# EasyEDA Pro project TL060FVXS07.eprj

# Schematic 6inch_mipi_V1.0
Board Name: shimeta_6inch_mipi_V1.0; Create Date: 2026-04-24; Page Name: 6inch_mipi_V1.0; Project Name: TL060FVXS07; Schematic Name: 6inch_mipi_V1.0; Update Date: 2026-05-01; Address1: *; Address2: *; Address3: *; Address4: *; Application_BuildNumber: *; ApprovedBy: *; Author: *; CheckedBy: *; CompanyName: *; CurrentDate: *; CurrentTime: *; Date: *; DocumentFullPathAndName: *; DocumentName: *; DocumentNumber: *; DrawnBy: *; Engineer: *; ImagePath: *; ModifiedDate: *; Organization: *; ProjectName: *; Revision: *; Rule: *; SheetNumber: 1; SheetTotal: 1; Time: *; Title: *
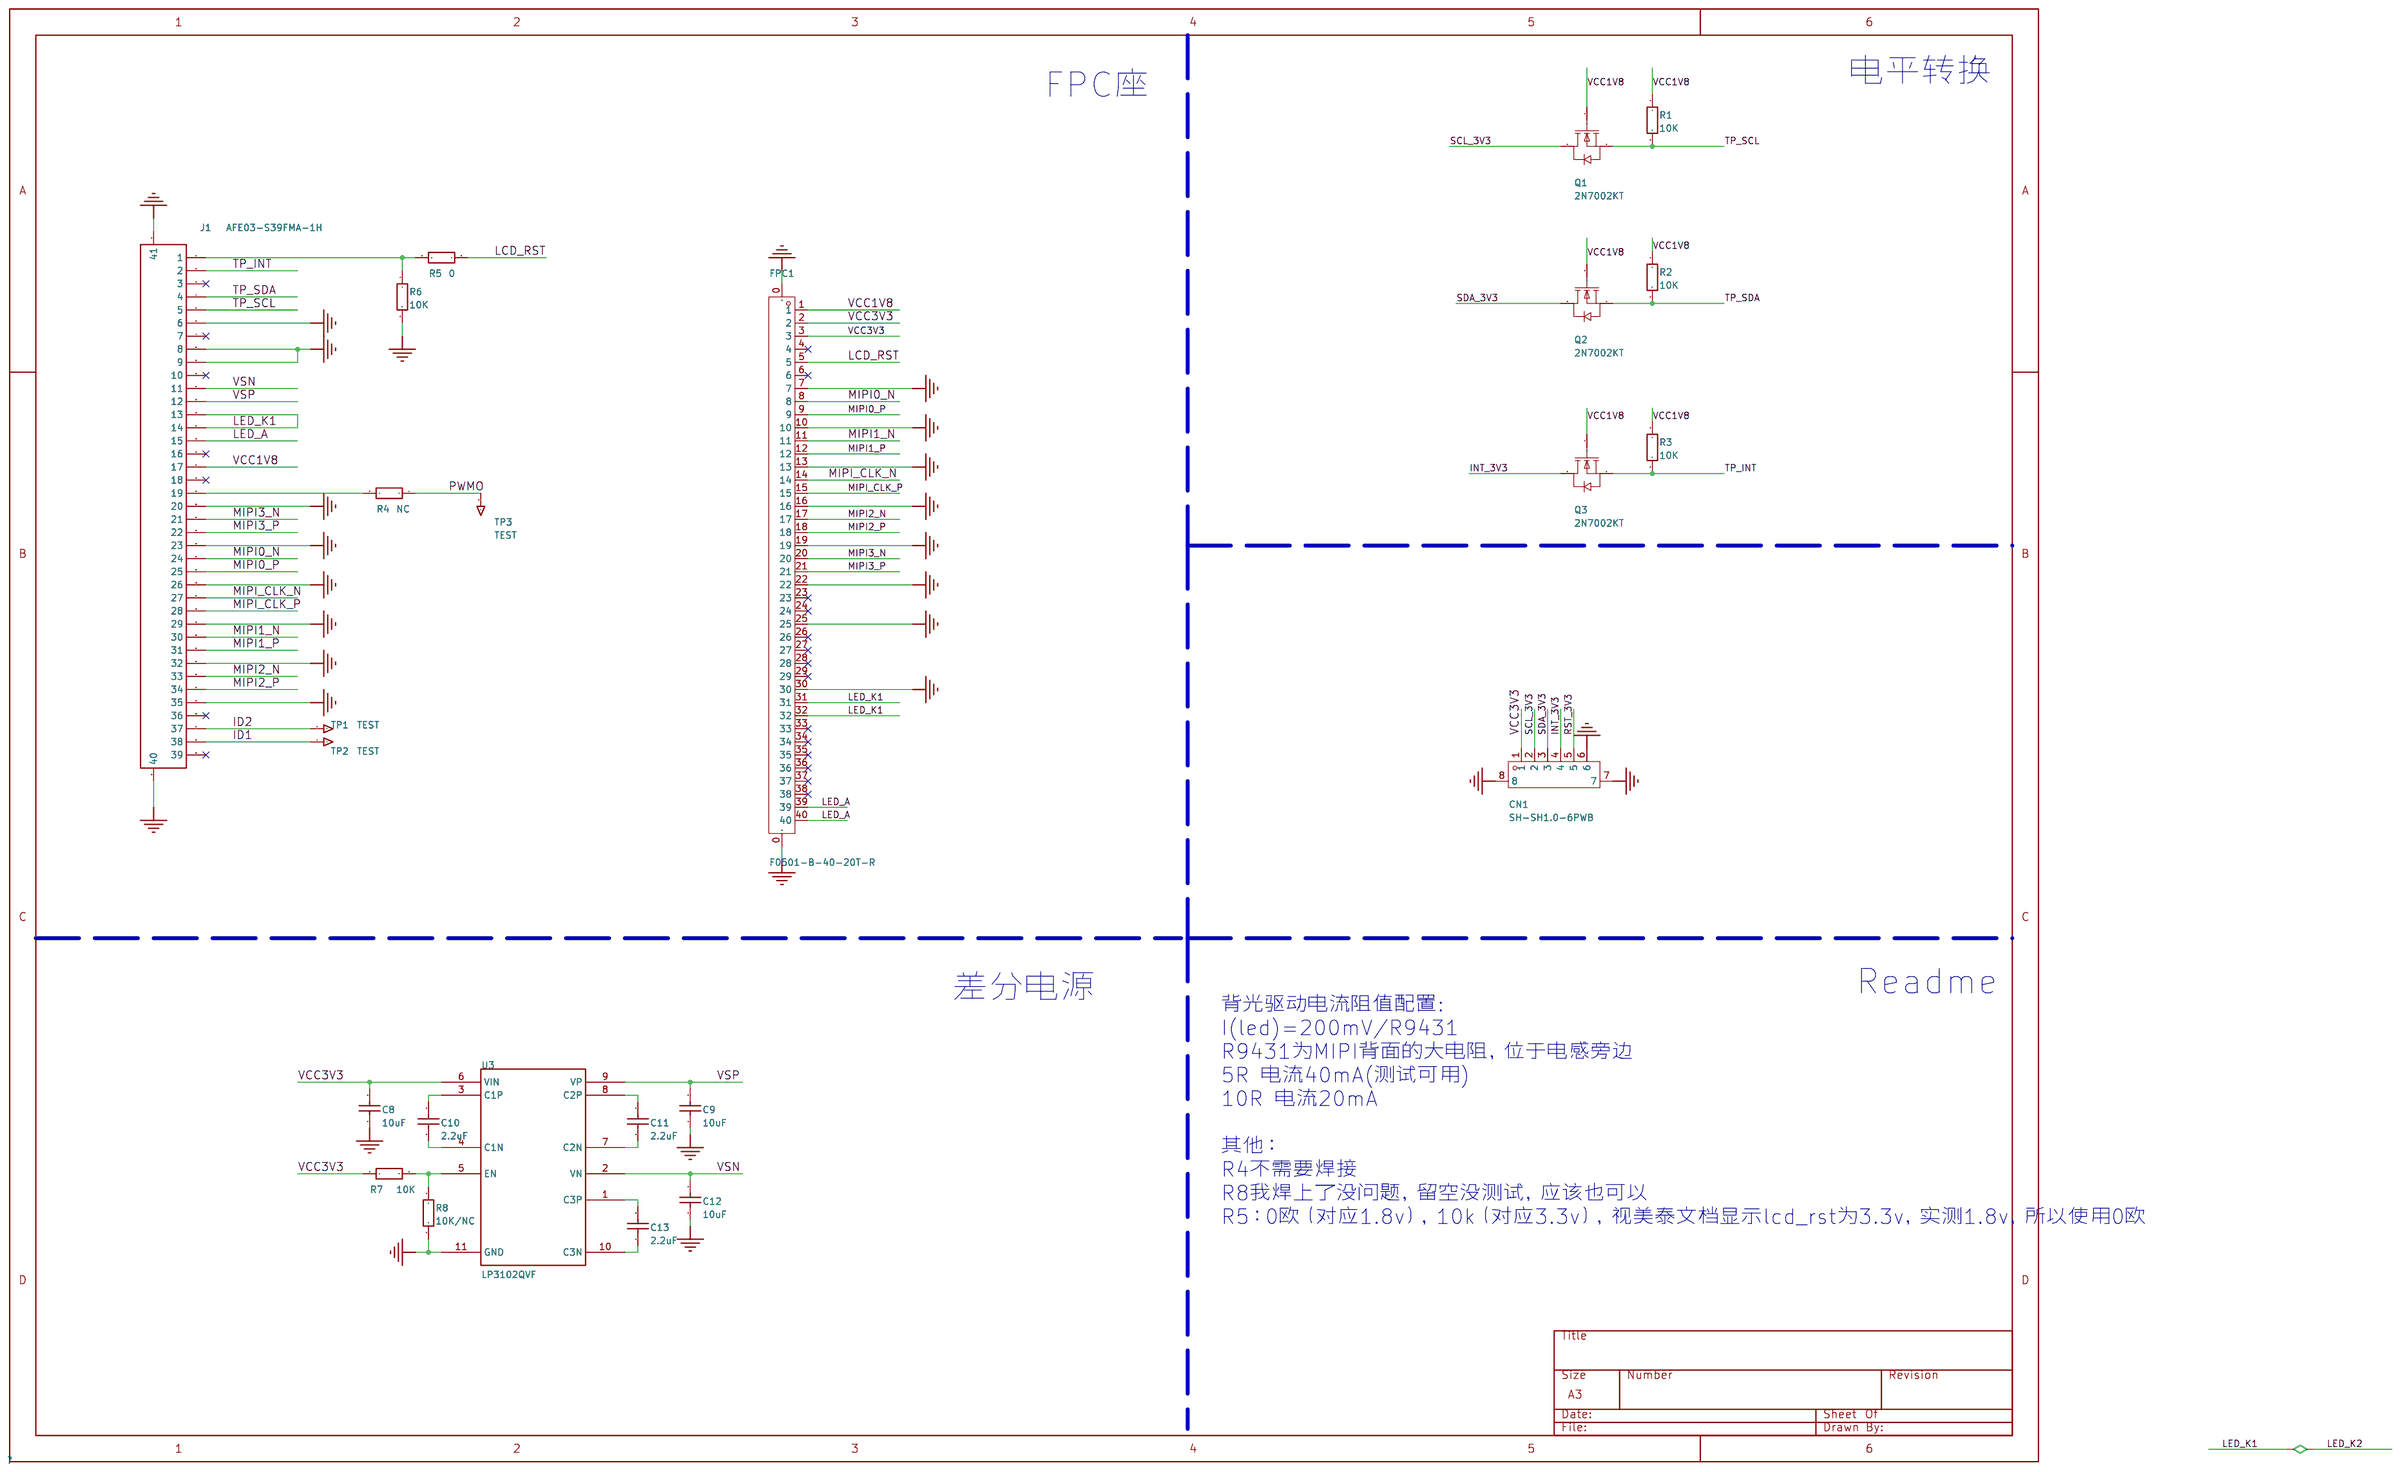
[diagram p0: schematic sheet]

## Parts
C8  10uF  [C0402_L]
C9  10uF  [C0402_L]
C10  2.2uF  [C0402_L]
C11  2.2uF  [C0402_L]
C12  10uF  [C0402_L]
C13  2.2uF  [C0402_L]
CN1  SH-SH1.0-6PWB  [CONN-SMD_6P-P1.00_SH-SH1.0-6PWB]
FPC1  F0501-B-40-20T-R  [FPC-SMD_40P-P0.50_L4.4-W25.6]
J1  AFE03-S39FMA-1H  [FPC-SMD_P0.30-39P_FGS-XJ-H1.0]
Q1  2N7002KT  [SOT-523_L1.6-W0.8-P0.95-LS1.6-BR]
Q2  2N7002KT  [SOT-523_L1.6-W0.8-P0.95-LS1.6-BR]
Q3  2N7002KT  [SOT-523_L1.6-W0.8-P0.95-LS1.6-BR]
R1  10K  [R0402_L]
R2  10K  [R0402_L]
R3  10K  [R0402_L]
R4  NC  [R0402_L]
R5  0  [R0402_L]
R6  10K  [R0402_L]
R7  10K  [R0402_L]
R8  10K/NC  [R0402_L]
TP1  TEST  [TEST 1.6]
TP2  TEST  [TEST 1.6]
TP3  TEST  [TEST 1.6]
U3  LP3102QVF  [TDFN-10_L3.0-W3.0-P0.50-BL-EP]

## Library data of the parts
C8 C9 C12 = 10uF: 贴片电容/MLCC电容; BOM名称: 无极性贴片电容; 联系卖家，免费查找封装: 唯一出售店铺网址https://shop463601444.taobao.com; Origin Footprint 1: C0201_L; Origin Footprint 2: C0603_L; Origin Footprint 3: C0805_L; Origin Footprint 4: C1206_L; Origin Footprint 5: C1210_L; Origin Footprint 6: C1808_L; Origin Footprint 7: C1812_L; Origin Footprint 8: C1825_L; Origin Footprint 9: C2225_L; Origin Footprint 10: C0201_M; Origin Footprint 11: C0402_M; Origin Footprint 12: C0603_M; Origin Footprint 13: C0805_M; Origin Footprint 14: C1206_M; Origin Footprint 15: C1210_M; Origin Footprint 16: C1808_M; Origin Footprint 17: C1812_M; Origin Footprint 18: C1825_M; Origin Footprint 19: C2225_M; Origin Footprint 20: C0201_NS; Origin Footprint 21: C0402_NS; Origin Footprint 22: C01005_NS; Design Item ID: C; Library Name: 0.1 - 电阻-电容-电感-晶振-晶体-磁珠-电位器-法拉电容-馈通电容
C10 C11 C13 = 2.2uF: 贴片电容/MLCC电容; BOM名称: 无极性贴片电容; 联系卖家，免费查找封装: 唯一出售店铺网址https://shop463601444.taobao.com; Origin Footprint 1: C0201_L; Origin Footprint 2: C0603_L; Origin Footprint 3: C0805_L; Origin Footprint 4: C1206_L; Origin Footprint 5: C1210_L; Origin Footprint 6: C1808_L; Origin Footprint 7: C1812_L; Origin Footprint 8: C1825_L; Origin Footprint 9: C2225_L; Origin Footprint 10: C0201_M; Origin Footprint 11: C0402_M; Origin Footprint 12: C0603_M; Origin Footprint 13: C0805_M; Origin Footprint 14: C1206_M; Origin Footprint 15: C1210_M; Origin Footprint 16: C1808_M; Origin Footprint 17: C1812_M; Origin Footprint 18: C1825_M; Origin Footprint 19: C2225_M; Origin Footprint 20: C0201_NS; Origin Footprint 21: C0402_NS; Origin Footprint 22: C01005_NS; Design Item ID: C; Library Name: 0.1 - 电阻-电容-电感-晶振-晶体-磁珠-电位器-法拉电容-馈通电容
CN1 = SH-SH1.0-6PWB: LCSC Part Name: 1.0-6P卧贴 编带; Supplier Part: C42372466; Manufacturer: SHOU HAN(首韩); Supplier Footprint: SMD,P=1mm,卧贴; Datasheet: https://item.szlcsc.com/datasheet/SH-SH1.0-6PWB/44255904.html; Supplier: LCSC; Pins Structure: 1x6P; Pitch: 1mm; Mounting Type: 卧贴; Reference Series: SH; Number of Pins: 6P; Number of Rows: 1; Number of PINs Per Row: 6; Current Rating: 1A; Contact Material: 磷青铜; Contact Plating: 锡; Operating Temperature: -25℃~+85℃; Voltage Rating: 125V; Plastic Material: LCP; Flame Retardant Rating: UL94V-0; Color: 米色
FPC1 = F0501-B-40-20T-R: LCSC Part Name: 抽屉式 下接 P数:40P 间距:0.5mm; Supplier Part: C481234; Manufacturer: XFCN(兴飞); Supplier Footprint: SMD,P=0.5mm,卧贴; JLCPCB Part Class: Extended Part; Datasheet: https://item.szlcsc.com/datasheet/F0501-B-40-20T-R/488819.html; Supplier: LCSC; Locking Feature: 抽屉式; Contact Type: 下接; Number of Contacts: 40P; Pitch: 0.5mm; Mounting Type: 卧贴; Height Above Board: 2mm; Contact Material: 磷青铜; Contact Plating: 锡; Operating Temperature: -25℃~+85℃; Rated Voltage (Max): 50V; Current Rating (Max): 400mA
J1 = AFE03-S39FMA-1H: FPC座下接 0.3mm 39P; Library Name: 个人库
Q1-Q3 = 2N7002KT_C45406498: LCSC Part Name: 60V N通道增强模式MOSFET; Supplier Part: C45406498; Manufacturer: MDD(辰达半导体); Supplier Footprint: SOT-523; JLCPCB Part Class: Extended Part; Datasheet: https://item.szlcsc.com/datasheet/2N7002KT/47507896.html; Supplier: LCSC; Drain to Source Voltage: 60V; Current - Continuous Drain(Id): 340mA; RDS(on): 3.2Ω@4.5V; Pd - Power Dissipation: 150mW; Gate Threshold Voltage (Vgs(th)): 2.5V@1mA; Input Capacitance(Ciss): 40pF; Reverse Transfer Capacitance (Crss@Vds): 10pF; Type: N沟道; Output Capacitance(Coss): 30pF
R1-R3 R6 R8 = 10K/NC: 贴片电阻; BOM名称: 贴片电阻; 联系卖家，免费查找封装: 唯一出售店铺网址https://shop463601444.taobao.com; Origin Footprint 1: R0201_L; Origin Footprint 2: R0603_L; Origin Footprint 3: R0805_L; Origin Footprint 4: R1206_L; Origin Footprint 5: R1210_L; Origin Footprint 6: R1812_L; Origin Footprint 7: R2010_L; Origin Footprint 8: R2512_L; Origin Footprint 9: R0201_M; Origin Footprint 10: R0402_M; Origin Footprint 11: R0603_M; Origin Footprint 12: R0805_M; Origin Footprint 13: R1206_M; Origin Footprint 14: R1210_M; Origin Footprint 15: R1812_M; Origin Footprint 16: R2010_M; Origin Footprint 17: R2512_M; Origin Footprint 18: R0201_NS; Origin Footprint 19: R0402_NS; Origin Footprint 20: R01005_NS; Design Item ID: R; Library Name: 0.1 - 电阻-电容-电感-晶振-晶体-磁珠-电位器-法拉电容-馈通电容
R4 = NC: 贴片电阻; BOM名称: 贴片电阻; 联系卖家，免费查找封装: 唯一出售店铺网址https://shop463601444.taobao.com; Origin Footprint 1: R0201_L; Origin Footprint 2: R0603_L; Origin Footprint 3: R0805_L; Origin Footprint 4: R1206_L; Origin Footprint 5: R1210_L; Origin Footprint 6: R1812_L; Origin Footprint 7: R2010_L; Origin Footprint 8: R2512_L; Origin Footprint 9: R0201_M; Origin Footprint 10: R0402_M; Origin Footprint 11: R0603_M; Origin Footprint 12: R0805_M; Origin Footprint 13: R1206_M; Origin Footprint 14: R1210_M; Origin Footprint 15: R1812_M; Origin Footprint 16: R2010_M; Origin Footprint 17: R2512_M; Origin Footprint 18: R0201_NS; Origin Footprint 19: R0402_NS; Origin Footprint 20: R01005_NS; Design Item ID: R; Library Name: 0.1 - 电阻-电容-电感-晶振-晶体-磁珠-电位器-法拉电容-馈通电容
R5 R7 = 10K: 贴片电阻; BOM名称: 贴片电阻; 联系卖家，免费查找封装: 唯一出售店铺网址https://shop463601444.taobao.com; Origin Footprint 1: R0201_L; Origin Footprint 2: R0603_L; Origin Footprint 3: R0805_L; Origin Footprint 4: R1206_L; Origin Footprint 5: R1210_L; Origin Footprint 6: R1812_L; Origin Footprint 7: R2010_L; Origin Footprint 8: R2512_L; Origin Footprint 9: R0201_M; Origin Footprint 10: R0402_M; Origin Footprint 11: R0603_M; Origin Footprint 12: R0805_M; Origin Footprint 13: R1206_M; Origin Footprint 14: R1210_M; Origin Footprint 15: R1812_M; Origin Footprint 16: R2010_M; Origin Footprint 17: R2512_M; Origin Footprint 18: R0201_NS; Origin Footprint 19: R0402_NS; Origin Footprint 20: R01005_NS; Design Item ID: R; Library Name: 0.1 - 电阻-电容-电感-晶振-晶体-磁珠-电位器-法拉电容-馈通电容
TP1-TP3 = TEST: 测试点; BOM名称: 测试点; 联系卖家，免费查找封装: 唯一出售店铺网址https://shop463601444.taobao.com; 封装库来自淘宝卖家ID：黄晶宝石: 其他店铺购入的，请立即申请退款，本店现金奖励20~500元; Origin Footprint 1: TEST 1; Origin Footprint 2: TEST 1.4; Origin Footprint 3: TEST 1.8; Origin Footprint 4: TEST 1.2; Origin Footprint 5: TEST 0.8; Origin Footprint 6: TEST 2.0; Origin Footprint 7: TEST 2.2; Origin Footprint 8: TEST 2.4; Origin Footprint 9: TEST 2.6; Library Name: 0.5 - 按键_开关_蜂鸣器_保险丝_电池_测试点_Mark点_铜柱
U3 = LP3102QVF: 双路电荷泵DC/DC; Library Name: 个人库

## Nets
GND: C8.1 C9.1 C12.1 CN1.6 CN1.7 CN1.8 FPC1.0 FPC1.7 FPC1.10 FPC1.13 FPC1.16 FPC1.19 FPC1.22 FPC1.25 FPC1.30 J1.6 J1.8 J1.9 J1.20 J1.23 J1.26 J1.29 J1.32 J1.35 J1.40 J1.41 R6.2 R8.2 U3.11(GND)
VCC1V8: FPC1.1 J1.17 Q1.1(G) Q2.1(G) Q3.1(G) R1.1 R2.1 R3.1
VCC3V3: C8.2 CN1.1 FPC1.2 FPC1.3 R7.1 U3.6(VIN)
ID1: J1.38 TP2.1
ID2: J1.37 TP1.1
INT_3V3: CN1.4 Q3.3(D)
LCD_RST: FPC1.5 R5.1
LED_A: FPC1.39 FPC1.40 J1.15
LED_K1: FPC1.31 FPC1.32 J1.13 J1.14
MIPI0_N: FPC1.8 J1.24
MIPI0_P: FPC1.9 J1.25
MIPI1_N: FPC1.11 J1.30
MIPI1_P: FPC1.12 J1.31
MIPI2_N: FPC1.17 J1.33
MIPI2_P: FPC1.18 J1.34
MIPI3_N: FPC1.20 J1.21
MIPI3_P: FPC1.21 J1.22
MIPI_CLK_N: FPC1.14 J1.27
MIPI_CLK_P: FPC1.15 J1.28
PWMO: R4.1 TP3.1
RST_3V3: CN1.5
SCL_3V3: CN1.2 Q1.3(D)
SDA_3V3: CN1.3 Q2.3(D)
TP_INT: J1.2 Q3.2(S) R3.2
TP_SCL: J1.5 Q1.2(S) R1.2
TP_SDA: J1.4 Q2.2(S) R2.2
VSN: C12.2 J1.11 U3.2(VN)
VSP: C9.2 J1.12 U3.9(VP)
$1N81: J1.19 R4.2
$1N84: J1.1 R5.2 R6.1
$1N85: C10.2 U3.3(C1P)
$1N86: C10.1 U3.4(C1N)
$1N87: C11.2 U3.8(C2P)
$1N88: C11.1 U3.7(C2N)
$1N89: C13.2 U3.1(C3P)
$1N90: C13.1 U3.10(C3N)
$1N96: R7.2 R8.1 U3.5(EN)

Not connected (* = marked no-connect by the designer): FPC1 4* 6* 23* 24* 26* 27* 28* 29* 33* 34* 35* 36* 37* 38*; J1 3* 7* 10* 16* 18* 36* 39*

## Notes on the sheet
- 电平转换
- FPC座
- 差分电源
- 背光驱动电流阻值配置:
  I(led)=200mV/R9431
  R9431为MIPI背面的大电阻，位于电感旁边
  5R 电流40mA(测试可用)
  10R 电流20mA
  其他：
  R4不需要焊接
  R8我焊上了没问题，留空没测试，应该也可以
  R5：0欧（对应1.8v），10k（对应3.3v），视美泰文档显示lcd_rst为3.3v，实测1.8v，所以使用0欧
- Readme

# Board 6inch_mipi_V1.0
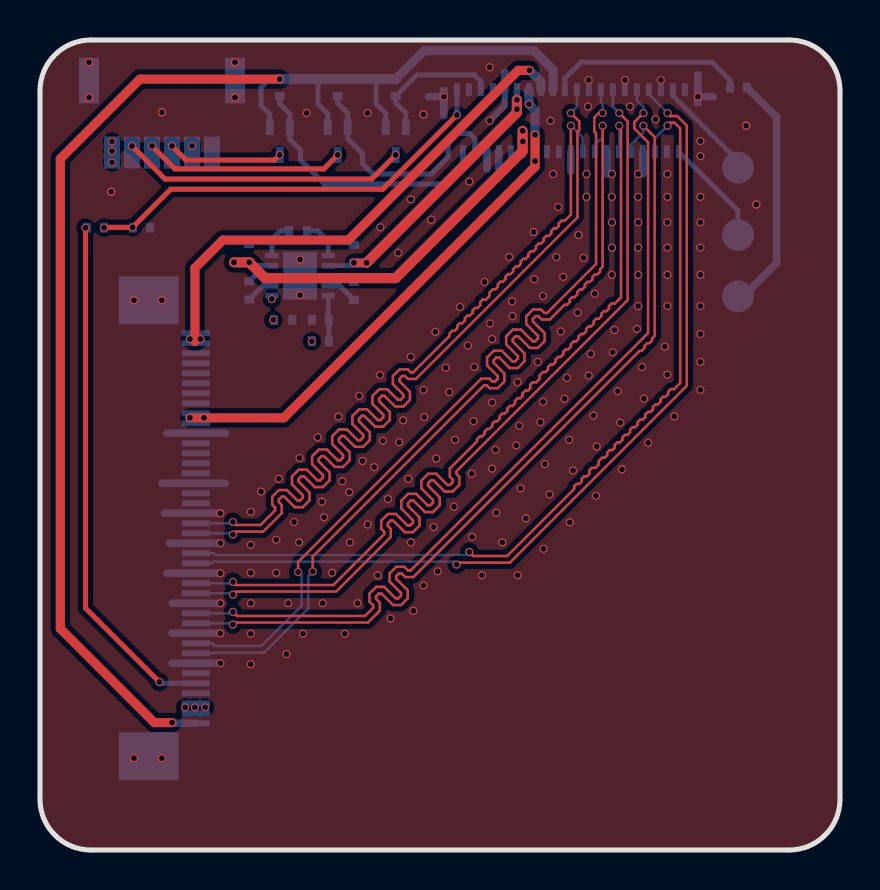
[diagram p1: board, top side]
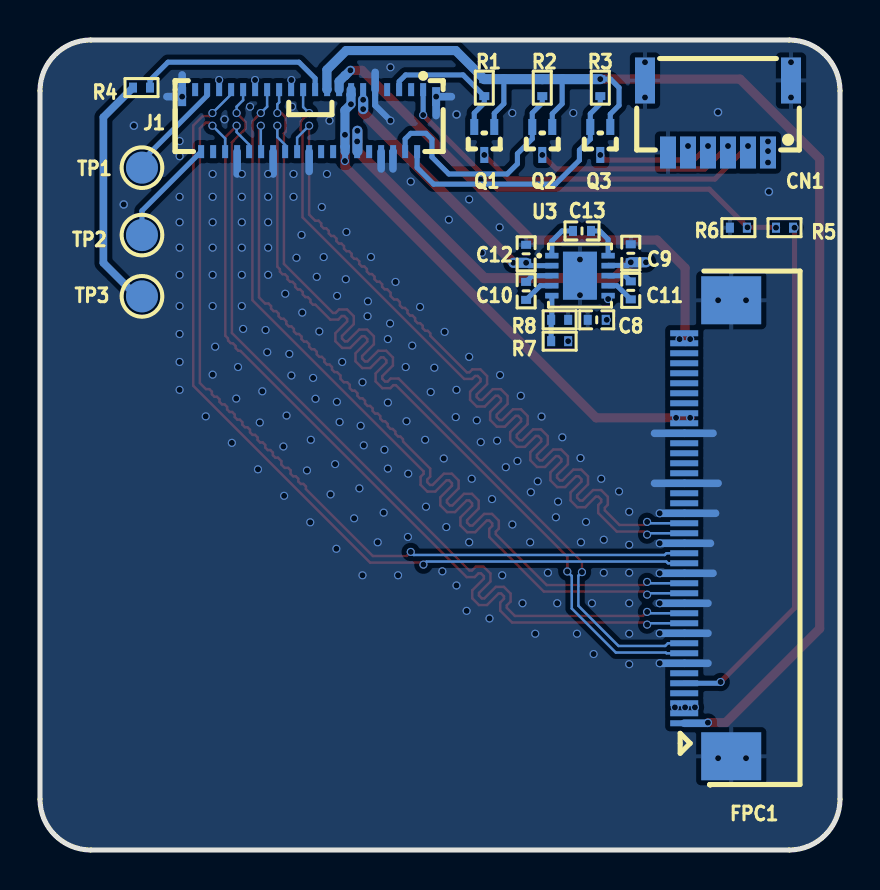
[diagram p2: board, bottom side, seen from below]

Outline 40 x 40.5 mm; copper layers: Top Layer, GND, PWR, Bottom Layer. Coordinates in mm from the lower left corner of the outline.
Outline path: 0,37.96 0,2.54 arc(0.74,0.74) 2.54,0 37.46,0 arc(39.26,0.74) 40,2.54 40,37.96 arc(39.26,39.76) 37.46,40.5 2.54,40.5 arc(0.74,39.76) 0,37.96
Stack: Top Layer 0.0356mm / Dielectric 2 0.0711mm PP-006 er 4.1 / GND 0.035mm / Dielectric 1 0.32mm FR-4 er 4.8 / PWR 0.035mm / Dielectric 3 0.0711mm PP-006 er 4.1 / Bottom Layer 0.0356mm

## Design rules (mm)
net MIPI_CLK_P: MIPI_CLK
net MIPI_CLK_N: MIPI_CLK
net MIPI3_P: MIPI3
net MIPI3_N: MIPI3
net MIPI2_P: MIPI2
net MIPI2_N: MIPI2
net MIPI1_P: MIPI1
net MIPI1_N: MIPI1
net MIPI0_P: MIPI0
net MIPI0_N: MIPI0
template: 用户自定义配置
spacing Clearance_PLOY (default): track to track 0.102, other pairs 0.152 to 0.3
spacing Clearance: track to track 0.127, other pairs 0.127 to 0.229
spacing Clearance-TRACK: track to track 0.102, other pairs 0.102 to 0.102
spacing Clearance_Edge_Ploy: track to track 0.762, other pairs 0.762 to 0.762
spacing Clearance_HOLE: track to track 1.016, other pairs 0 to 1.016
spacing Clearance_Key: track to track 1.016, other pairs 0 to 1.016
spacing Clearance_1: track to track 0.152, other pairs 0.152 to 0.152
spacing Clearance_5VOUT2: track to track 0.127, other pairs 0.127 to 0.127
spacing Clearance_5VOUT1: track to track 0.127, other pairs 0.127 to 0.127
spacing Clearance_Isvia_To_Istrack: track to track 0.127, other pairs 0.127 to 0.127
spacing Clearance_Isvia_To_Ispad: track to track 0.127, other pairs 0.127 to 0.127
spacing Clearance_Isvia_To_Isvia: track to track 0.127, other pairs 0.127 to 0.127
spacing Clearance_BGA: track to track 0.152, other pairs 0.152 to 0.152
spacing Clearance_Isvia_To_Ploy: track to track 0.254, other pairs 0.254 to 0.254
track width Width (default): min 0.127, default 0.127, max 2.54
track width Width_VDD: min 0.254, default 0.254, max 2.54
track width Width_BGA: min 0.127, default 0.127, max 0.254
differential pair DiffPairsRouting (default): width min 0.124, default 0.124, max 0.124; gap min 0.203, default 0.203
via RoutingVias: diameter min 0.6, default 0.6, max 1.27; hole min 0.3, default 0.3, max 0.711
via RoutingVias_VDD: diameter min 1, default 1, max 1.27; hole min 0.5, default 0.5, max 0.711
via RoutingVias_BGA (default): diameter min 0.406, default 0.406, max 1.27; hole min 0.203, default 0.203, max 0.711

## Placement (name value [footprint] x y rotation side)
C8  10uF  [C0402_L]  12.16 26.51 180 bottom
C9  10uF  [C0402_L]  10.46 29.84 270 bottom
C10  2.2uF  [C0402_L]  15.69 27.96 90 bottom
C11  2.2uF  [C0402_L]  10.46 27.98 90 bottom
C12  10uF  [C0402_L]  15.69 29.81 270 bottom
C13  2.2uF  [C0402_L]  12.9 30.95 0 bottom
CN1  SH-SH1.0-6PWB  [CONN-SMD_6P-P1.00_SH-SH1.0-6PWB]  6.1 36.67 0 bottom
FPC1  F0501-B-40-20T-R  [FPC-SMD_40P-P0.50_L4.4-W25.6]  6.61 16.09 90 bottom
J1  AFE03-S39FMA-1H  [FPC-SMD_P0.30-39P_FGS-XJ-H1.0]  26.54 36.47 0 bottom
Q1  2N7002KT  [SOT-523_L1.6-W0.8-P0.95-LS1.6-BR]  17.79 35.45 90 bottom
Q2  2N7002KT  [SOT-523_L1.6-W0.8-P0.95-LS1.6-BR]  14.89 35.45 90 bottom
Q3  2N7002KT  [SOT-523_L1.6-W0.8-P0.95-LS1.6-BR]  11.99 35.45 90 bottom
R1  10K  [R0402_L]  17.79 38.12 270 bottom
R2  10K  [R0402_L]  14.89 38.12 270 bottom
R3  10K  [R0402_L]  11.99 38.12 270 bottom
R4  NC  [R0402_L]  34.93 38.12 180 bottom
R5  0  [R0402_L]  2.77 31.12 0 bottom
R6  10K  [R0402_L]  5.08 31.12 0 bottom
R7  10K  [R0402_L]  14.02 25.44 0 bottom
R8  10K/NC  [R0402_L]  14.02 26.51 180 bottom
TP1  TEST  [TEST 1.6]  34.9 34.12 180 bottom
TP2  TEST  [TEST 1.6]  34.9 30.75 180 bottom
TP3  TEST  [TEST 1.6]  34.9 27.68 180 bottom
U3  LP3102QVF  [TDFN-10_L3.0-W3.0-P0.50-BL-EP]  13 28.72 270 bottom

## Footprints (pads in the part's own frame, mm; a bottom-side part is the same pattern mirrored in y, then rotated)
C0402_L
  rect 0.4x0.5 smd: 1(-0.45,0) 2(0.45,0)
CONN-SMD_6P-P1.00_SH-SH1.0-6PWB
  rect 0.8x1.6 smd: 1(-2.5,1.8) 2(-1.5,1.8) 3(-0.5,1.8) 4(0.5,1.8) 5(1.5,1.8) 6(2.5,1.8)
  rect 1x2.3 smd: 7(3.65,-1.8) 8(-3.65,-1.8)
FPC-SMD_40P-P0.50_L4.4-W25.6
  rect 2.4x3 smd: 0(-11.4,-1.175) 0(11.4,-1.175)
  rect 0.3x1.4 smd: 1(-9.75,1.175) 2(-9.25,1.175) 3(-8.75,1.175) 4(-8.25,1.175) 5(-7.75,1.175) 6(-7.25,1.175) 7(-6.75,1.175) 8(-6.25,1.175) 9(-5.75,1.175) 10(-5.25,1.175) 11(-4.75,1.175) 12(-4.25,1.175) 13(-3.75,1.175) 14(-3.25,1.175) 15(-2.75,1.175) 16(-2.25,1.175) 17(-1.75,1.175) 18(-1.25,1.175) 19(-0.75,1.175) 20(-0.25,1.175) 21(0.25,1.175) 22(0.75,1.175) 23(1.25,1.175) 24(1.75,1.175) 25(2.25,1.175) 26(2.75,1.175) 27(3.25,1.175) 28(3.75,1.175) 29(4.25,1.175) 30(4.75,1.175) 31(5.25,1.175) 32(5.75,1.175) 33(6.25,1.175) 34(6.75,1.175) 35(7.25,1.175) 36(7.75,1.175) 37(8.25,1.175) 38(8.75,1.175) 39(9.25,1.175) 40(9.75,1.175)
FPC-SMD_P0.30-39P_FGS-XJ-H1.0
  rect 0.3x0.65 smd: 1(-5.7,-1.55) 2(-5.4,1.55) 3(-5.1,-1.55) 4(-4.8,1.55) 5(-4.5,-1.55) 6(-4.2,1.55) 7(-3.9,-1.55) 8(-3.6,1.55) 9(-3.3,-1.55) 10(-3,1.55) 11(-2.7,-1.55) 12(-2.4,1.55) 13(-2.1,-1.55) 14(-1.8,1.55) 15(-1.5,-1.55) 16(-1.2,1.55) 17(-0.9,-1.55) 18(-0.6,1.55) 19(-0.3,-1.55) 20(0,1.55) 21(0.3,-1.55) 22(0.6,1.55) 23(0.9,-1.55) 24(1.2,1.55) 25(1.5,-1.55) 26(1.8,1.55) 27(2.1,-1.55) 28(2.4,1.55) 29(2.7,-1.55) 30(3,1.55) 31(3.3,-1.55) 32(3.6,1.55) 33(3.9,-1.55) 34(4.2,1.55) 35(4.5,-1.55) 36(4.8,1.55) 37(5.1,-1.55) 38(5.4,1.55) 39(5.7,-1.55)
  rect 0.4x0.95 smd: 40(-6.35,-1.2) 41(6.35,-1.2)
R0402_L
  rect 0.4x0.5 smd: 1(-0.425,0) 2(0.425,0)
SOT-523_L1.6-W0.8-P0.95-LS1.6-BR
  rect 0.8x0.4 smd: 1(0.7,-0.5) 2(0.7,0.5) 3(-0.7,0)
TDFN-10_L3.0-W3.0-P0.50-BL-EP
  rect 0.28x0.665 smd: 1(-1,-1.407) 2(-0.5,-1.407) 3(0,-1.407) 4(0.5,-1.407) 5(1,-1.407) 6(1,1.407) 7(0.5,1.407) 8(0,1.407) 9(-0.5,1.407) 10(-1,1.407)
  rect 2.4x1.7 smd: 11(0,0)
TEST 1.6
  round 1.6 smd: 1(0,0)

## Nets
As in the schematic.

Pads without a net: FPC1 4 6 23 24 26 27 28 29 33 34 35 36 37 38; J1 3 7 10 16 18 36 39

## Via types
v1: diameter 0.406, hole 0.3, Top Layer to Bottom Layer, 231 vias
v2: diameter 0.425, hole 0.3, Top Layer to Bottom Layer, 13 vias

## Routing (per net, layer and track width the routed paths; a pad name or vN(x,y) marks a point on that pad's centre or on a via; arc(x,y) is an arc through that point)
GND: length 32.6
  Bottom Layer w0.305: J1.9 23.24,37.23 v1(22.48,36.47)
  Bottom Layer w0.381: 6.6,10.84 v1(9.02,10.84) ; v1(9.02,13.84) 6.35,13.84 ; 6.1,18.34 9.27,18.34 ; J1.9 23.24,38.88 ; 9.02,9.34 6.6,9.34 ; 22.35,34.06 22.35,34.91 J1.6 ; 20.19,36.72 v1(20.19,37.67) 19.43,37.67 ; J1.8 22.94,34.06 ; 6.6,12.34 9.02,12.34 ; v1(9.02,16.84) 6.22,16.84 ; 32.89,38.75 v1(32.89,37.67) 33.66,37.67 ; 6.35,20.84 9.27,20.84 ; J1.20 26.54,33.93 ; J1.32 30.14,33.8 ; J1.26 28.34,33.8 ; v1(9.02,15.34) 6.48,15.34
  vias: v1(9.02,12.34) v1(9.02,9.34) v1(10.54,16.91) v1(10.54,15.26) v1(10.54,13.86) v1(10.54,12.34) v1(10.54,10.81) v1(10.54,9.29) v1(11.05,17.93) v1(11.81,15.51) v1(11.81,13.86) v1(11.94,18.56) v1(12.32,9.8) v1(12.4,12.34) v1(12.7,16.4) v1(13,29.52) v1(13,27.74) v1(12.97,19.6) v1(12.95,15.39) v1(13.15,10.81) v1(13.34,36.85) v1(13.89,20.64) v1(14.1,17.42) v1(14.14,12.34) v1(14.21,16.64) v1(14.6,13.86) v1(14.92,21.67) v1(15.11,18.43) v1(15.24,10.81) v1(15.46,17.89) v1(15.49,15.39) v1(15.88,12.34) v1(15.96,22.71) v1(16.13,19.45) v1(16.38,36.85) v1(16.38,16.28) v1(16.71,19.14) v1(16.89,13.73) v1(17.02,31.13) v1(17,23.75) v1(17.15,20.47) v1(17.4,17.55) v1(17.53,11.58) v1(17.91,29.86) v1(17.96,20.39) v1(18.16,21.48) v1(18.41,18.56) v1(18.54,32.53) v1(18.54,24.66) v1(18.54,15.39) v1(18.67,11.96) v1(19.18,23.01) v1(19.21,21.65) v1(19.18,13.23) v1(19.56,31.52) v1(19.69,16.15) v1(19.77,25.91) v1(19.81,19.58) v1(19.88,13.93) v1(20.28,24.11) v1(20.47,22.9) v1(20.74,20.51) v1(20.7,17.16) v1(21,27.15) v1(21.39,25.22) v1(21.46,33.42) v1(21.59,18.81) v1(21.6,15.65) v1(21.72,24.15) v1(21.67,21.44) v1(22.1,13.73) v1(22.22,28.4) v1(22.48,39.14) v1(22.5,26.33) v1(22.61,25.55) v1(22.61,22.37) v1(22.61,19.07) v1(22.78,20.01) v1(22.82,16.87) v1(23.11,15.39) v1(23.45,29.65) v1(23.6,27.43) v1(23.62,26.69) v1(23.81,20.23) v1(23.88,23.39) v1(23.88,13.73) v1(23.97,21.21) v1(24.03,18.08) v1(24.29,16.58) v1(24.68,30.9) v1(24.71,28.54) v1(24.89,24.4) v1(25.02,21.4) v1(25.15,27.7) v1(25.16,22.41) v1(25.25,19.3) v1(25.18,15.06) v1(25.53,36.47) v1(25.47,17.78) v1(25.65,33.8) v1(25.82,29.65) v1(25.91,32.15) v1(26.03,25.93) v1(26.16,28.66) v1(26.23,22.56) v1(26.34,23.6) v1(26.46,20.51) v1(26.49,16.38) v1(26.65,18.98) v1(26.92,30.75) v1(26.89,26.87) v1(27.18,29.61) v1(27.32,33.8) v1(27.32,32.66) v1(27.43,38.5) v1(27.4,37.17) v1(27.43,23.73) v1(27.53,24.8) v1(27.74,27.81) v1(27.67,21.72) v1(27.83,20.18) v1(27.79,17.71) v1(28.59,33.8) v1(28.59,32.66) v1(28.59,31.39) v1(28.59,30.12) v1(28.59,28.76) v1(28.64,24.89) v1(28.72,26) v1(28.89,22.94) v1(29.01,21.37) v1(29.1,19.03) v1(29.25,38.5) v1(29.5,37.17) v1(29.84,26.05) v1(29.91,33.8) v1(29.91,32.66) v1(29.91,31.39) v1(29.91,30.12) v1(29.91,28.76) v1(29.91,27.2) v1(30.1,24.15) v1(30.19,22.57) v1(30.41,20.36) v1(30.77,36.53) v1(31.04,38.5) v1(31.24,25.17) v1(31.37,33.8) v1(31.37,32.66) v1(31.37,31.39) v1(31.37,30.12) v1(31.37,28.76) v1(31.37,27.2) v1(31.37,23.77) v1(31.71,21.68) v1(33.02,35.45) v1(33.02,34.69) v1(33.02,32.66) v1(33.02,31.39) v1(33.02,30.12) v1(33.02,28.76) v1(33.02,27.2) v1(33.02,25.8) v1(33.02,24.4) v1(33.02,23.01) v2(2.45,39.39) v2(2.45,37.63) v2(3.56,32.91) v2(4.7,27.49) v2(4.7,4.59) v2(6.1,36.89) v2(6.09,27.49) v2(6.09,4.59) v2(9.75,39.39) v2(9.75,37.63) v2(19.17,36.78) v2(35.31,36.21) v2(35.81,32.28)
VCC1V8: length 68.9
  Top Layer w0.457: v1(11.99,38.54) 5,38.54 1.02,34.56 1.02,11.07 5.72,6.37 v1(6.6,6.37)
  Bottom Layer w0.254: Q3.1 11.49,36.79 11.05,37.23 11.05,38.12 11.47,38.54 v1(11.99,38.54) ; 13.89,38.54 13.89,37.31 14.39,36.81 Q2.1 ; Q1.1 17.29,36.83 16.81,37.31 16.81,38.54
  Bottom Layer w0.381: 7.79,6.34 6.64,6.34 v1(6.6,6.37)
  Bottom Layer w0.457: J1.17 25.65,38.03 25.65,39.01 24.69,39.97 19.21,39.97 R1.1
  Bottom Layer w0.508: R1.1 R2.1 v1(11.99,38.54)
VCC3V3:
  vias: v1(3.6,35.43) v1(3.6,34.95) v1(3.6,34.38) v1(7.25,7.13) v1(7.75,7.13) v1(8.25,7.13) v1(11.59,27.55) v1(11.66,26.51) v1(13.59,25.44)
ID1: length 5.4
  Bottom Layer w0.254: TP2.1 34.9,31.96 J1.38
ID2: length 4.6
  Bottom Layer w0.254: J1.37 31.64,37.72 34.67,34.69
INT_3V3: length 5.8
  Top Layer w0.254: v1(6.6,35.2) 7.3,34.5 11.73,34.5 v1(11.99,34.75)
LCD_RST: length 26.1
  Top Layer w0.254: v1(2.27,31.12) 2.27,12.1 v1(5.97,8.4)
  Bottom Layer w0.254: v1(5.97,8.4) 6.03,8.34 7.79,8.34
LED_A: length 25.7
  Top Layer w0.457: 7.75,25.42 7.75,29.1 9.14,30.5 15.42,30.5 23.9,38.98 v1(24.48,38.98)
  Bottom Layer w0.457: J1.15 25.04,38.43 24.75,38.72 24.74,38.72 v1(24.48,38.98)
  vias: v1(7.49,25.55) v1(8.02,25.55)
LED_K1: length 27.3
  Top Layer w0.457: v1(7.49,21.61) v1(8.2,21.61) 12.19,21.61 24.75,34.17 v1(24.75,34.45) v1(24.75,35.76)
  Bottom Layer w0.457: J1.13 24.44,37.77 24.45,37.76 v1(24.45,37.29) 24.75,36.99 v1(24.75,35.76) 24.75,35.17 24.74,35.16 J1.14
MIPI0_N: length 44.1
  Top Layer w0.124: v1(13.63,13.93) 13.63,14.67 22.21,23.24 22.33,23.24 22.48,23.09 22.88,23.09 23.22,23.43 23.22,23.83 22.68,24.36 22.68,24.49 22.83,24.63 22.95,24.63 23.49,24.1 23.89,24.1 24.22,24.43 24.22,24.83 23.64,25.42 23.64,25.55 23.78,25.69 23.91,25.69 24.49,25.1 24.89,25.1 25.23,25.44 25.23,25.84 24.64,26.43 24.64,26.55 24.78,26.7 24.91,26.7 25.09,26.52 25.49,26.52 26.23,27.26 26.35,27.27 26.48,27.39 26.48,27.52 26.61,27.64 26.73,27.65 26.86,27.77 26.86,27.9 26.99,28.03 27.11,28.03 27.24,28.15 27.24,28.28 27.37,28.41 27.5,28.41 27.62,28.54 27.62,28.66 27.75,28.79 27.88,28.79 28,28.92 28.01,29.04 28.13,29.17 v1(28.13,36.21)
  Bottom Layer w0.124: J1.24 27.74,35.25 28.13,35.64 v1(28.13,36.21) ; 7.79,9.84 8.68,9.84 8.71,9.87 11.21,9.87 13.41,12.07 13.41,13.7 v1(13.63,13.93)
MIPI0_P: length 44.1
  Top Layer w0.124: v1(28.13,36.85) 27.94,36.85 27.71,36.62 27.71,35.92 27.8,35.83 27.8,29.3 25.35,26.85 25.22,26.85 25.05,27.03 24.65,27.03 24.31,26.69 24.31,26.29 24.9,25.7 24.9,25.58 24.76,25.43 24.63,25.43 24.04,26.02 23.64,26.02 23.31,25.69 23.31,25.28 23.89,24.7 23.89,24.57 23.75,24.43 23.62,24.43 23.09,24.96 22.69,24.96 22.35,24.63 22.35,24.23 22.89,23.69 22.89,23.56 22.75,23.42 22.62,23.42 22.47,23.57 22.07,23.57 12.9,14.41 v1(12.9,13.89)
  Bottom Layer w0.124: J1.25 28.04,37.38 28.13,37.29 v1(28.13,36.85) ; v1(12.9,13.89) 13.08,13.72 13.08,12.21 11.07,10.2 8.74,10.2 8.6,10.34 7.79,10.34
MIPI1_N: length 44.1
  Top Layer w0.124: v1(9.65,11.27) 9.75,11.38 16.4,11.38 16.99,11.97 16.99,12.37 16.8,12.56 16.8,12.68 16.94,12.83 17.07,12.83 17.65,12.25 18.05,12.25 18.39,12.58 18.39,12.98 17.81,13.56 17.81,13.69 17.95,13.83 18.08,13.83 18.26,13.64 18.66,13.64 29.97,24.95 30.09,24.96 30.21,25.09 30.23,25.21 30.35,25.33 30.47,25.35 30.59,25.47 30.61,25.59 30.73,25.71 30.73,35.65 v1(30.17,36.21)
  Bottom Layer w0.124: v1(30.17,36.21) 30.17,35.9 29.54,35.27 J1.30 ; v1(9.65,11.27) 9.58,11.34 7.79,11.34
MIPI1_P: length 44.1
  Top Layer w0.124: v1(30.17,36.85) 29.72,36.4 29.72,36.07 30.4,35.39 30.4,25.85 18.53,13.98 18.4,13.98 18.21,14.16 17.81,14.16 17.48,13.83 17.48,13.43 18.05,12.85 18.05,12.72 17.91,12.58 17.78,12.58 17.21,13.16 16.81,13.16 16.47,12.82 16.47,12.42 16.66,12.23 16.66,12.11 16.26,11.7 9.85,11.7 v1(9.65,11.91)
  Bottom Layer w0.124: J1.31 29.84,37.49 30.17,37.17 v1(30.17,36.85) ; 7.79,11.84 9.58,11.84 v1(9.65,11.91)
MIPI2_N: length 44.1
  Top Layer w0.124: v1(20.83,14.27) 20.93,14.37 23.5,14.37 32.34,23.21 32.34,36.22 31.86,36.7 31.52,36.7 31.38,36.84 v1(31.38,36.85)
  Bottom Layer w0.124: v1(31.38,36.85) 30.44,37.78 J1.33 ; 7.79,14.34 8.6,14.34 8.69,14.42 20.68,14.42 v1(20.83,14.27)
MIPI2_P: length 44.1
  Top Layer w0.124: v1(21.46,14.9) 21.67,14.7 23.36,14.7 26.71,18.05 26.7,18.18 26.83,18.31 26.96,18.3 27.09,18.43 27.09,18.56 27.21,18.69 27.34,18.68 27.47,18.81 27.47,18.98 27.59,19.11 27.76,19.11 27.93,19.28 27.93,19.45 28.1,19.62 28.23,19.61 28.36,19.74 28.36,19.87 28.48,20 28.61,20 28.74,20.12 28.74,20.25 28.86,20.38 28.99,20.38 29.12,20.5 29.12,20.63 29.25,20.76 29.37,20.76 29.5,20.88 29.5,21.01 29.63,21.14 29.75,21.14 29.88,21.27 29.88,21.39 30.01,21.52 30.14,21.52 30.26,21.65 30.26,21.77 30.39,21.9 30.52,21.9 30.64,22.03 30.64,22.15 30.77,22.28 30.9,22.28 31.03,22.41 31.03,22.53 31.15,22.66 31.28,22.66 31.41,22.79 31.41,22.92 31.53,23.04 31.7,23.04 32.01,23.35 32.01,36.08 31.72,36.37 31.52,36.37 31.38,36.22 v1(31.38,36.21)
  Bottom Layer w0.124: J1.34 30.74,35.58 v1(31.38,36.21) ; 7.79,14.84 8.68,14.84 8.76,14.75 21.31,14.75 v1(21.46,14.9)
MIPI3_N: length 44.1
  Top Layer w0.124: v1(26.54,36.85) 26.96,36.43 26.96,36 26.87,35.91 26.87,31.63 18.79,23.55 18.39,23.55 18.24,23.7 18.12,23.7 17.97,23.56 17.97,23.43 18.5,22.91 18.5,22.51 18.16,22.17 17.76,22.17 17.22,22.71 17.09,22.71 16.95,22.57 16.95,22.44 17.49,21.9 17.49,21.5 17.16,21.17 16.76,21.17 16.22,21.71 16.09,21.71 15.95,21.56 15.95,21.44 16.49,20.89 16.49,20.49 16.15,20.16 15.75,20.16 15.21,20.7 15.08,20.7 14.94,20.56 14.94,20.43 15.48,19.89 15.48,19.49 15.15,19.15 14.75,19.15 14.2,19.69 14.08,19.69 13.94,19.55 13.94,19.42 14.48,18.88 14.48,18.48 14.14,18.15 13.74,18.15 13.2,18.69 13.07,18.69 12.93,18.55 12.93,18.42 13.47,17.88 13.47,17.48 13.14,17.14 12.74,17.14 12.21,17.67 12.08,17.67 11.94,17.53 11.94,17.4 12.09,17.25 12.09,16.85 11.16,15.92 9.8,15.92 v1(9.65,15.77)
  Bottom Layer w0.124: J1.21 26.84,37.15 v1(26.54,36.85) ; v1(9.65,15.77) 9.58,15.84 7.79,15.84
MIPI3_P: length 44.1
  Top Layer w0.124: v1(26.54,36.21) 26.54,31.77 26.24,31.46 26.07,31.46 25.94,31.34 25.94,31.21 25.81,31.08 25.69,31.08 25.56,30.95 25.56,30.83 25.43,30.7 25.31,30.7 25.18,30.57 25.18,30.45 25.05,30.32 24.93,30.32 24.8,30.19 24.8,30.07 24.67,29.94 24.54,29.94 24.42,29.81 24.42,29.69 24.29,29.56 24.16,29.56 24.04,29.43 24.04,29.3 23.91,29.18 23.78,29.18 23.66,29.05 23.66,28.92 23.53,28.8 23.4,28.8 23.28,28.67 23.28,28.54 23.15,28.42 23.02,28.42 22.89,28.29 22.89,28.16 22.77,28.03 22.64,28.03 22.47,27.86 22.47,27.7 22.3,27.53 22.13,27.52 22.01,27.4 22,27.23 21.88,27.1 21.75,27.1 21.63,26.97 21.62,26.85 21.5,26.72 21.37,26.72 21.25,26.59 21.24,26.47 21.12,26.34 20.99,26.34 20.86,26.21 20.86,26.09 20.74,25.96 20.61,25.96 20.48,25.83 20.48,25.71 18.66,23.88 18.53,23.88 18.38,24.03 17.98,24.03 17.64,23.7 17.64,23.3 18.17,22.77 18.17,22.65 18.02,22.5 17.9,22.5 17.36,23.04 16.96,23.04 16.62,22.71 16.62,22.31 17.16,21.77 17.16,21.64 17.02,21.5 16.89,21.5 16.35,22.04 15.95,22.04 15.62,21.7 15.62,21.3 15.63,21.29 15.63,21.29 16.16,20.76 16.16,20.63 16.02,20.49 15.89,20.49 15.35,21.03 14.95,21.03 14.61,20.69 14.61,20.29 15.15,19.75 15.15,19.62 15.01,19.48 14.88,19.48 14.34,20.02 13.94,20.02 13.6,19.69 13.6,19.29 14.15,18.75 14.15,18.62 14.01,18.48 13.88,18.48 13.34,19.02 12.94,19.02 12.6,18.68 12.6,18.28 13.14,17.74 13.14,17.61 13,17.47 12.87,17.47 12.35,18 11.95,18 11.61,17.66 11.61,17.26 11.76,17.11 11.76,16.98 11.03,16.25 9.8,16.25 v1(9.65,16.4)
  Bottom Layer w0.124: 7.79,16.34 9.58,16.34 v1(9.65,16.4) ; J1.22 27.14,35.61 v1(26.54,36.21)
MIPI_CLK_N: length 44.1
  Top Layer w0.124: v1(28.96,36.85) 29.38,36.43 29.38,27.49 20.82,18.93 20.82,18.81 20.97,18.66 20.97,18.26 20.63,17.92 20.23,17.92 19.67,18.48 19.54,18.48 19.4,18.34 19.4,18.22 19.98,17.63 19.98,17.23 19.65,16.9 19.25,16.9 18.67,17.48 18.54,17.48 18.4,17.34 18.4,17.21 18.98,16.63 18.98,16.23 18.64,15.89 18.24,15.89 17.66,16.47 17.53,16.47 17.39,16.33 17.39,16.2 17.54,16.05 17.54,15.65 14.81,12.92 9.8,12.92 v1(9.65,12.77)
  Bottom Layer w0.124: 7.79,12.84 9.58,12.84 v1(9.65,12.77) ; v1(28.96,36.85) 28.64,37.17 J1.27
MIPI_CLK_P: length 44.1
  Top Layer w0.124: v1(9.65,13.4) 9.8,13.25 14.67,13.25 17.21,15.79 17.21,15.92 17.06,16.07 17.06,16.47 17.4,16.8 17.8,16.8 18.38,16.22 18.5,16.22 18.65,16.37 18.65,16.49 18.07,17.07 18.07,17.47 18.4,17.81 18.8,17.81 19.38,17.23 19.51,17.23 19.65,17.37 19.65,17.5 19.07,18.08 19.07,18.48 19.41,18.81 19.81,18.81 20.37,18.25 20.5,18.25 20.64,18.39 20.64,18.52 20.49,18.67 20.49,19.07 21.84,20.42 21.85,20.54 21.98,20.67 22.1,20.68 22.22,20.81 22.24,20.92 22.36,21.05 22.48,21.06 22.61,21.19 22.62,21.3 22.74,21.43 22.86,21.44 22.99,21.57 22.99,21.69 23.11,21.82 23.24,21.82 23.37,21.95 23.37,22.08 23.5,22.2 23.62,22.2 23.75,22.33 23.75,22.46 23.88,22.58 24,22.58 24.13,22.71 24.13,22.84 24.26,22.97 24.38,22.97 24.51,23.09 24.51,23.26 24.64,23.39 24.81,23.39 24.98,23.56 24.98,23.72 25.15,23.89 25.27,23.89 25.4,24.02 25.4,24.15 25.53,24.28 25.65,24.28 25.78,24.4 25.78,24.53 25.91,24.66 26.03,24.66 26.16,24.78 26.16,24.91 26.29,25.04 26.42,25.04 26.54,25.17 26.54,25.29 26.67,25.42 26.8,25.42 26.92,25.55 26.92,25.67 27.05,25.8 27.18,25.8 27.31,25.93 27.31,26.05 27.43,26.18 27.56,26.18 27.69,26.31 27.69,26.44 27.81,26.56 27.94,26.56 28.07,26.69 28.07,26.82 28.19,26.94 28.32,26.94 28.45,27.07 28.45,27.2 28.57,27.32 28.74,27.32 29.05,27.63 29.05,36.13 v1(28.96,36.21)
  Bottom Layer w0.124: J1.28 28.96,34.94 v1(28.96,36.21) ; 7.79,13.34 9.58,13.34 v1(9.65,13.4)
PWMO: length 12
  Bottom Layer w0.381: R4.1 36.83,36.64 36.83,29.36 35.16,27.68 TP3.1
RST_3V3:
  vias: v1(7.6,35.2)
SCL_3V3: length 14.4
  Top Layer w0.254: v1(17.79,34.75) 16.58,33.55 6.25,33.55 v1(4.6,35.2)
SDA_3V3: length 10
  Top Layer w0.254: v1(14.89,34.75) 14.19,34.06 6.75,34.06 v1(5.6,35.2)
TP_INT: length 13.4
  Bottom Layer w0.254: R3.2 11.99,37.31 12.49,36.81 Q3.2 12.49,35.54 13.03,35 13.03,34.49 14.22,33.29 20.32,33.29 21.14,34.12 J1.2
TP_SCL: length 7
  Bottom Layer w0.254: Q1.2 18.29,36.85 17.79,37.35 R1.2 18.85,38.75 21.72,38.75 22.04,38.43 J1.5
TP_SDA: length 11.8
  Bottom Layer w0.254: J1.4 21.74,35.55 21.46,35.83 20.7,35.83 20.4,35.53 20.4,34.65 19.56,33.8 16.64,33.8 16.13,34.31 16.13,34.82 15.39,35.56 Q2.2 15.39,36.85 14.89,37.35 R2.2
VSN: length 14.3
  Top Layer w0.406: v1(16.33,29.36) v1(15.69,29.36)
  Top Layer w0.508: v1(23.84,37.51) v1(23.84,37.04) 23.84,36.87 v1(16.33,29.36)
  Bottom Layer w0.254: v1(15.69,29.36) 15.55,29.22 U3.2
  Bottom Layer w0.508: v1(23.84,37.04) v1(23.84,37.51) ; v1(16.33,29.36) v1(15.69,29.36)
VSP: length 21.4
  Top Layer w0.508: 24.13,35.41 24.13,34.94 17.78,28.59 11.25,28.59 v1(10.46,29.39) v1(9.7,29.39) ; v1(24.13,35.96) 24.13,35.44 v1(24.14,35.43)
  Bottom Layer w0.254: U3.9 11.58,29.23 10.62,29.23 v1(10.46,29.39)
  Bottom Layer w0.508: v1(24.13,35.96) 24.13,34.93 ; v1(9.7,29.39) v1(10.46,29.39)
$1N81: length 9.9
  Bottom Layer w0.254: J1.19 26.24,38.58 27.05,39.39 33.6,39.39 34.5,38.49 R4.2
$1N84: length 21.1
  Top Layer w0.254: 3.3,31.13 v1(4.63,31.13) 6.53,33.04 17.13,33.04 v1(20.84,36.75)
  Bottom Layer w0.254: v1(20.84,36.75) J1.1
  vias: v1(3.2,31.12)
$1N85: length 1.4
  Bottom Layer w0.254: U3.3 15.38,28.72 C10.2
$1N86: length 1.6
  Bottom Layer w0.254: C10.1 14.98,28.22 U3.4
$1N87: length 1.3
  Bottom Layer w0.254: U3.8 10.75,28.72 C11.2
$1N88: length 1.4
  Bottom Layer w0.254: C11.1 11.15,28.22 U3.7
$1N89: length 2
  Bottom Layer w0.254: U3.1 14.41,30.44 13.9,30.95 C13.2
$1N90: length 1.8
  Bottom Layer w0.254: U3.10 11.59,30.54 12.01,30.95 C13.1
$1N96: length 2.3
  Bottom Layer w0.254: U3.5 14.41,26.54 R8.1 R7.2

## Copper pours and planes (outline as drawn; the poured copper is in the pictures)
GND on Top Layer: -11.68,47.14 66.04,47.14 66.04,-6.46 -11.68,-6.46
GND on Bottom Layer: -8.64,45.36 69.09,45.36 69.09,-8.24 -8.64,-8.24
GND on GND: -6.1,44.22 71.63,44.22 71.63,-9.38 -6.1,-9.38
VCC3V3 on PWR: -4.19,42.56 73.53,42.56 73.53,-11.03 -4.19,-11.03
